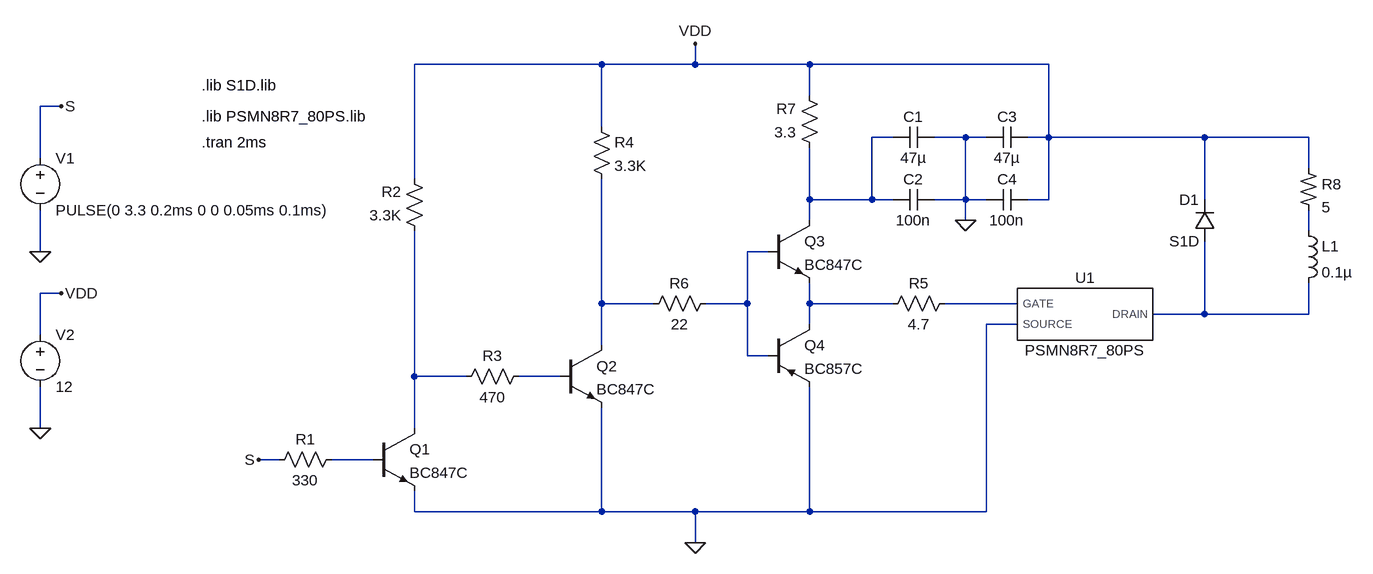
[diagram p0: schematic pwm_module.asc]
pwm_module.asc, the LTspice schematic file:
Version 4
SHEET 1 1432 680
WIRE 272 -480 -16 -480
WIRE 416 -480 416 -512
WIRE 416 -480 272 -480
WIRE 592 -480 416 -480
WIRE 960 -480 592 -480
WIRE 592 -432 592 -480
WIRE -560 -416 -592 -416
WIRE 272 -384 272 -480
WIRE 720 -368 688 -368
WIRE 832 -368 784 -368
WIRE 864 -368 832 -368
WIRE 960 -368 960 -480
WIRE 960 -368 928 -368
WIRE 1200 -368 960 -368
WIRE 1360 -368 1200 -368
WIRE -592 -336 -592 -416
WIRE 1360 -320 1360 -368
WIRE -16 -304 -16 -480
WIRE 592 -272 592 -352
WIRE 688 -272 688 -368
WIRE 688 -272 592 -272
WIRE 720 -272 688 -272
WIRE 832 -272 832 -368
WIRE 832 -272 784 -272
WIRE 864 -272 832 -272
WIRE 960 -272 960 -368
WIRE 960 -272 928 -272
WIRE 1200 -272 1200 -368
WIRE 592 -240 592 -272
WIRE 832 -240 832 -272
WIRE 1360 -224 1360 -256
WIRE -592 -192 -592 -256
WIRE 528 -192 496 -192
WIRE -560 -128 -592 -128
WIRE 272 -112 272 -304
WIRE 352 -112 272 -112
WIRE 496 -112 496 -192
WIRE 496 -112 432 -112
WIRE 592 -112 592 -144
WIRE 720 -112 592 -112
WIRE 912 -112 800 -112
WIRE 1200 -96 1200 -208
WIRE 1200 -96 1120 -96
WIRE 1360 -96 1360 -144
WIRE 1360 -96 1200 -96
WIRE 592 -80 592 -112
WIRE 912 -80 864 -80
WIRE -592 -64 -592 -128
WIRE 272 -48 272 -112
WIRE 496 -32 496 -112
WIRE 528 -32 496 -32
WIRE -16 0 -16 -224
WIRE 64 0 -16 0
WIRE 208 0 144 0
WIRE -592 80 -592 16
WIRE -16 80 -16 0
WIRE -224 128 -256 128
WIRE -80 128 -144 128
WIRE -16 208 -16 176
WIRE 272 208 272 48
WIRE 272 208 -16 208
WIRE 416 208 272 208
WIRE 592 208 592 16
WIRE 592 208 416 208
WIRE 864 208 864 -80
WIRE 864 208 592 208
WIRE 416 256 416 208
FLAG 416 256 0
FLAG 416 -512 VDD
FLAG 832 -240 0
FLAG -560 -416 S
FLAG -256 128 S
FLAG -592 -192 0
FLAG -560 -128 VDD
FLAG -592 80 0
SYMBOL npn -80 80 R0
SYMATTR InstName Q1
SYMATTR Value BC847C
SYMBOL npn 208 -48 R0
SYMATTR InstName Q2
SYMATTR Value BC847C
SYMBOL npn 528 -240 R0
SYMATTR InstName Q3
SYMATTR Value BC847C
SYMBOL pnp 528 -80 R0
SYMATTR InstName Q4
SYMATTR Value BC857C
SYMBOL res -128 112 R90
WINDOW 0 0 56 VBottom 2
WINDOW 3 32 56 VTop 2
SYMATTR InstName R1
SYMATTR Value 330
SYMBOL res 0 -208 R180
WINDOW 0 36 76 Left 2
WINDOW 3 36 40 Left 2
SYMATTR InstName R2
SYMATTR Value 3.3K
SYMBOL res 48 16 R270
WINDOW 0 32 56 VTop 2
WINDOW 3 0 56 VBottom 2
SYMATTR InstName R3
SYMATTR Value 470
SYMBOL res 256 -400 R0
SYMATTR InstName R4
SYMATTR Value 3.3K
SYMBOL res 816 -128 R90
WINDOW 0 0 56 VBottom 2
WINDOW 3 32 56 VTop 2
SYMATTR InstName R5
SYMATTR Value 4.7
SYMBOL res 448 -128 R90
WINDOW 0 0 56 VBottom 2
WINDOW 3 32 56 VTop 2
SYMATTR InstName R6
SYMATTR Value 22
SYMBOL res 608 -336 R180
WINDOW 0 36 76 Left 2
WINDOW 3 36 40 Left 2
SYMATTR InstName R7
SYMATTR Value 3.3
SYMBOL cap 784 -384 R90
WINDOW 0 0 32 VBottom 2
WINDOW 3 32 32 VTop 2
SYMATTR InstName C1
SYMATTR Value 47µ
SYMBOL cap 784 -288 R90
WINDOW 0 0 32 VBottom 2
WINDOW 3 32 32 VTop 2
SYMATTR InstName C2
SYMATTR Value 100n
SYMBOL cap 928 -384 R90
WINDOW 0 0 32 VBottom 2
WINDOW 3 32 32 VTop 2
SYMATTR InstName C3
SYMATTR Value 47µ
SYMBOL cap 928 -288 R90
WINDOW 0 0 32 VBottom 2
WINDOW 3 32 32 VTop 2
SYMATTR InstName C4
SYMATTR Value 100n
SYMBOL diode 1216 -208 R180
WINDOW 3 24 0 Left 2
WINDOW 0 24 64 Left 2
SYMATTR Value S1D
SYMATTR InstName D1
SYMBOL res2 1344 -320 R0
SYMATTR InstName R8
SYMATTR Value 5
SYMATTR SpiceLine pwr=25
SYMBOL ind 1344 -240 R0
SYMATTR InstName L1
SYMATTR Value 0.1µ
SYMBOL voltage -592 -352 R0
WINDOW 123 0 0 Left 2
WINDOW 39 0 0 Left 2
SYMATTR InstName V1
SYMATTR Value PULSE(0 3.3 0.2ms 0 0 0.05ms 0.1ms)
SYMBOL voltage -592 -80 R0
WINDOW 123 0 0 Left 2
WINDOW 39 0 0 Left 2
SYMATTR InstName V2
SYMATTR Value 12
SYMBOL PSMN8R7_80PS 1024 -96 M0
SYMATTR InstName U1
TEXT -344 -360 Left 2 !.tran 2ms
TEXT -344 -448 Left 2 !.lib S1D.lib
TEXT -344 -400 Left 2 !.lib PSMN8R7_80PS.lib

The netlist it stands for:
* pwm_module.asc
Q1 N008 N010 0 0 BC847C
Q2 N004 N009 0 0 BC847C
Q3 N001 N003 N005 0 BC847C
Q4 N005 N003 0 0 BC857C
R1 N010 S 330
R2 N008 VDD 3.3K
R3 N008 N009 470
R4 VDD N004 3.3K
R5 N006 N005 4.7
R6 N003 N004 22
R7 N001 VDD 3.3
C1 0 N001 47µ
C2 0 N001 100n
C3 VDD 0 47µ
C4 VDD 0 100n
D1 N007 VDD S1D
R8 VDD N002 5 pwr=25
L1 N002 N007 0.1µ
V1 S 0 PULSE(0 3.3 0.2ms 0 0 0.05ms 0.1ms)
V2 VDD 0 12
XU1 N007 N006 0 PSMN8R7_80PS  ; pins DRAIN GATE SOURCE
.model D D
.lib standard.dio
.model NPN NPN
.model PNP PNP
.lib standard.bjt
.tran 2ms
.lib S1D.lib
.lib PSMN8R7_80PS.lib
.lib PSMN8R7_80PS.lib
.backanno
.end